# Altium schematic sheet BIO26_pishield.SchDoc
size A4
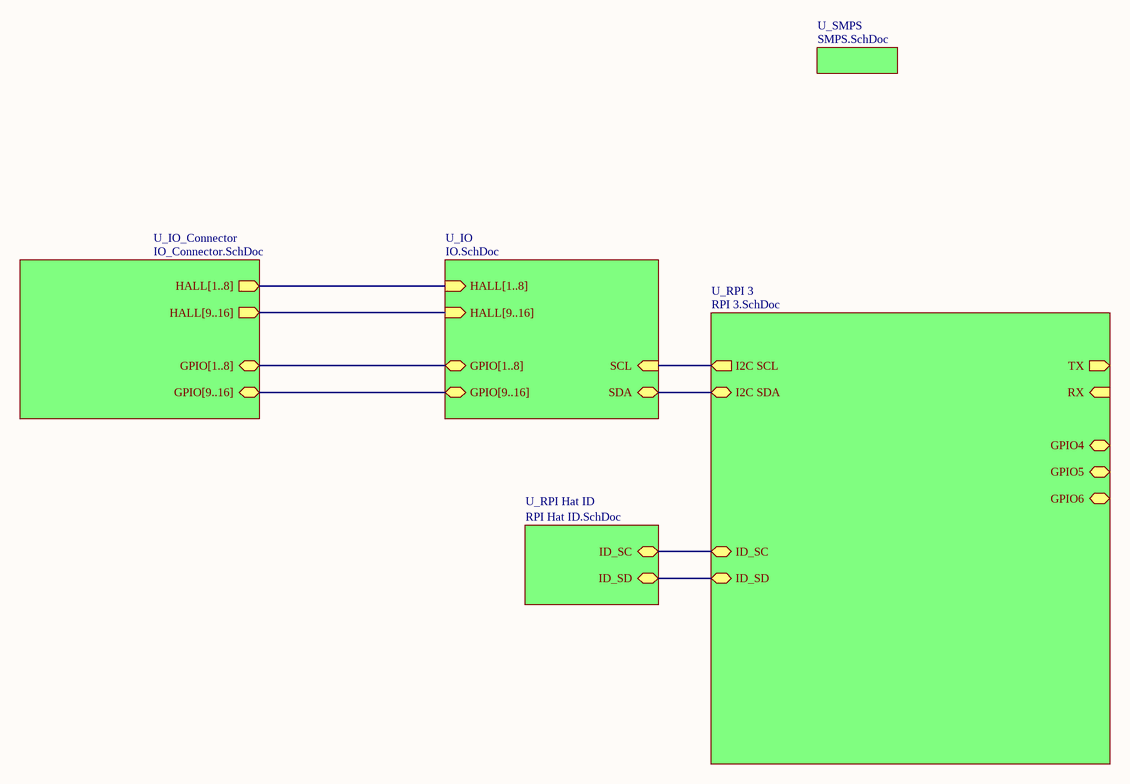
[diagram p0: BIO26_pishield.SchDoc]

## Sub-sheets
U_IO = IO.SchDoc: SCL (in), SDA (bidir), HALL[1..8] (in), HALL[9..16] (in), GPIO[1..8] (bidir), GPIO[9..16] (bidir)
U_IO_Connector = IO_Connector.SchDoc: HALL[1..8] (out), HALL[9..16] (out), GPIO[1..8] (bidir), GPIO[9..16] (bidir)
U_RPI 3 = RPI 3.SchDoc: GPIO4 (bidir), GPIO6 (bidir), GPIO5 (bidir), RX (in), TX (out), ID_SC (bidir), ID_SD (bidir), I2C SDA (bidir), I2C SCL (out)
U_RPI Hat ID = RPI Hat ID.SchDoc: ID_SC (bidir), ID_SD (bidir)
U_SMPS = SMPS.SchDoc: no entries

## Nets
(unnamed): sheet U_RPI 3/ID_SC, sheet U_RPI Hat ID/ID_SC
(unnamed): sheet U_RPI 3/ID_SD, sheet U_RPI Hat ID/ID_SD
(unnamed): sheet U_RPI 3/I2C SDA, sheet U_IO/SDA
(unnamed): sheet U_RPI 3/I2C SCL, sheet U_IO/SCL

## Buses and harness runs
bus sheet U_IO/GPIO[1..8] = sheet U_IO_Connector/GPIO[1..8]
bus sheet U_IO/GPIO[9..16] = sheet U_IO_Connector/GPIO[9..16]
bus sheet U_IO/HALL[1..8] = sheet U_IO_Connector/HALL[1..8]
bus sheet U_IO/HALL[9..16] = sheet U_IO_Connector/HALL[9..16]